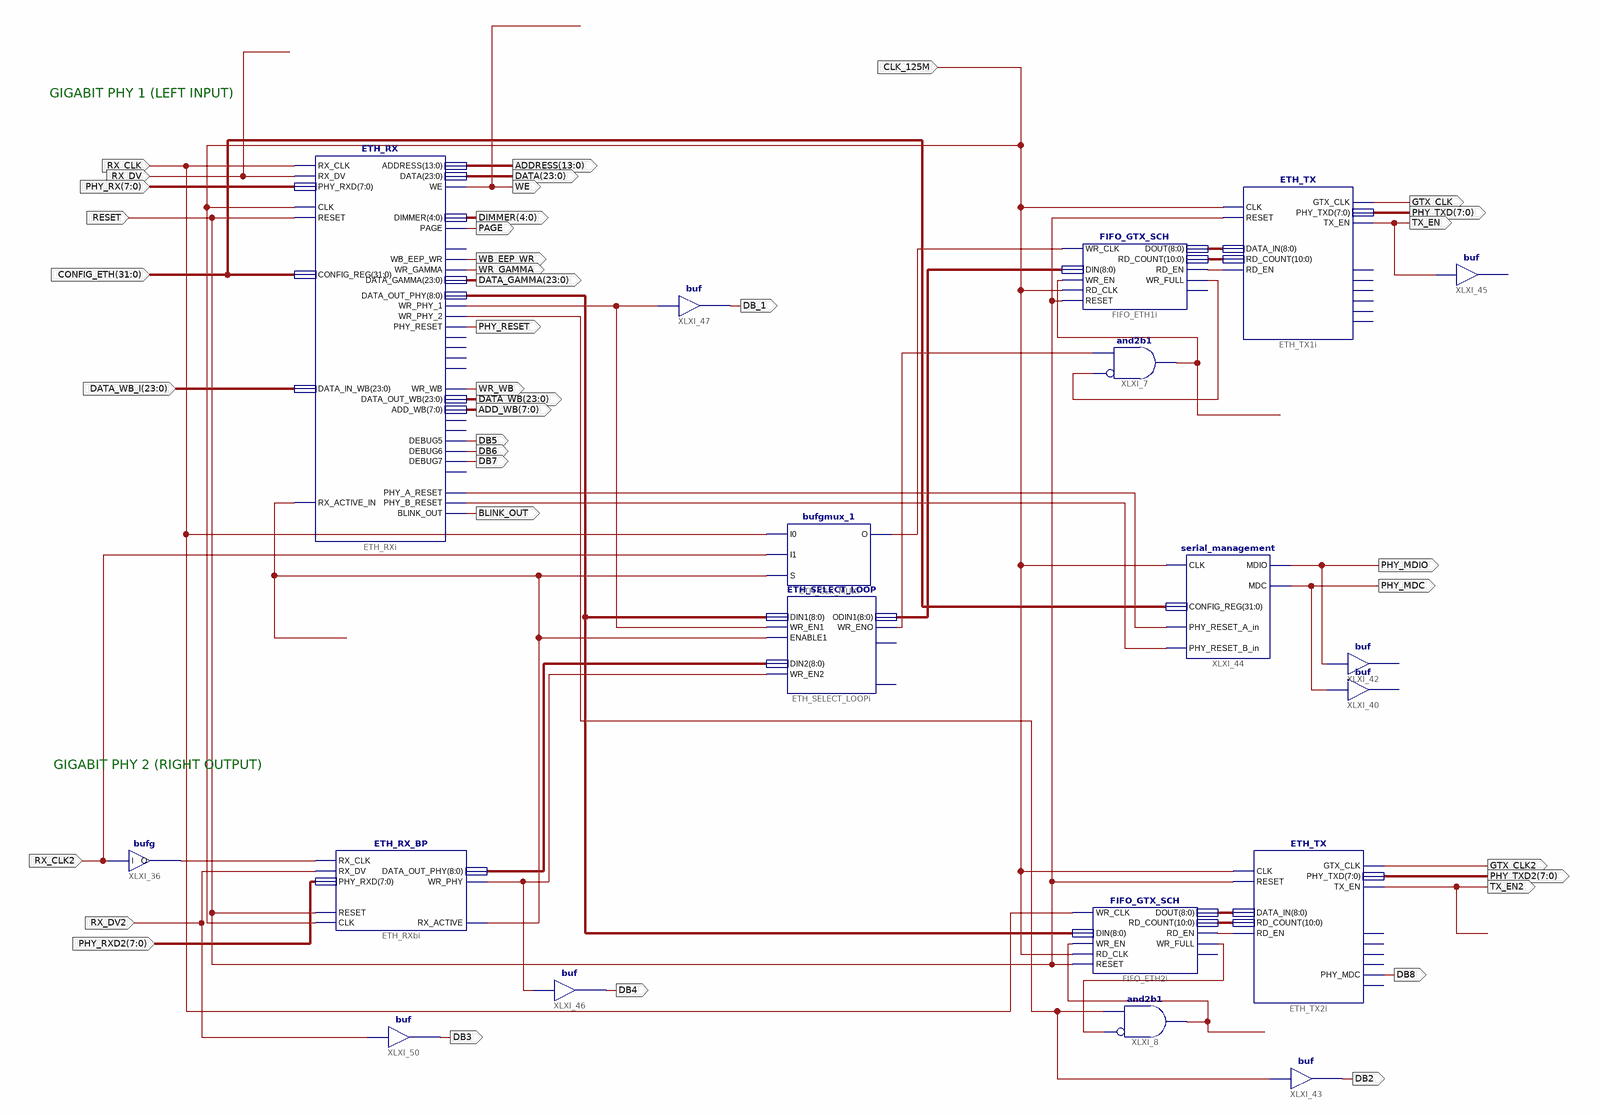
[diagram p0: schematic sheet 1]
// Xilinx ISE schematic ETH_Drive.sch (spartan6) as structural Verilog: 19 symbols, 39 ports
module ETH_Drive (
  input  CLK_125M,
  input  RX_CLK,
  input  RX_DV,
  input  [7:0] PHY_RX,
  input  [31:0] CONFIG_ETH,
  input  [23:0] DATA_WB_I,
  input  RX_DV2,
  input  [7:0] PHY_RXD2,
  input  RX_CLK2,
  input  RESET,
  output [4:0] DIMMER,
  output PAGE,
  output WB_EEP_WR,
  output WR_GAMMA,
  output [23:0] DATA_GAMMA,
  output [23:0] DATA_WB,
  output [7:0] ADD_WB,
  output WR_WB,
  output PHY_RESET,
  output DB5,
  output DB6,
  output DB7,
  output DB8,
  output GTX_CLK2,
  output [7:0] PHY_TXD2,
  output TX_EN2,
  output DB2,
  output PHY_MDIO,
  output PHY_MDC,
  output [13:0] ADDRESS,
  output [23:0] DATA,
  output WE,
  output DB_1,
  output GTX_CLK,
  output [7:0] PHY_TXD,
  output TX_EN,
  output DB3,
  output DB4,
  output BLINK_OUT
);

  wire DB1, XLXN_253, XLXN_254, XLXN_283, XLXN_284, XLXN_285, XLXN_286, XLXN_287, XLXN_292, XLXN_345,
       XLXN_370, XLXN_371, XLXN_372, XLXN_375, XLXN_389;
  wire [8:0] XLXN_1, XLXN_29, XLXN_202, XLXN_232, XLXN_237;
  wire [10:0] XLXN_249, XLXN_250;

  ETH_RX ETH_RXi (
    .CLK(CLK_125M), .RESET(RESET), .RX_CLK(RX_CLK), .RX_DV(RX_DV), .RX_ACTIVE_IN(XLXN_370), .PHY_RXD(PHY_RX),
    .DATA_IN_WB(DATA_WB_I), .CONFIG_REG(CONFIG_ETH), .PHY_RESET(PHY_RESET), .WE(WE), .WR_PHY_1(XLXN_375),
    .WR_PHY_2(XLXN_345), .WR_GAMMA(WR_GAMMA), .WR_WB(WR_WB), .WB_EEP_WR(WB_EEP_WR), .BLINK_OUT(BLINK_OUT),
    .PAGE(PAGE), .PHY_B_RESET(XLXN_372), .PHY_A_RESET(XLXN_371), .DEBUG5(DB5), .DEBUG6(DB6), .DEBUG7(DB7),
    .ADDRESS(ADDRESS), .DATA(DATA), .DATA_OUT_PHY(XLXN_202), .DATA_GAMMA(DATA_GAMMA), .DATA_OUT_WB(DATA_WB),
    .ADD_WB(ADD_WB), .DIMMER(DIMMER));  // open: LED_ERROR_TG, RST_WB_BRAM, LED_OS, DEBUG1, DEBUG2, DEBUG3, DEBUG4, DEBUG8
  and XLXI_7 (XLXN_284, ~XLXN_285, XLXN_283);  // and2b1
  and XLXI_8 (XLXN_287, ~XLXN_286, XLXN_345);  // and2b1
  ETH_RX_BP ETH_RXbi (
    .RX_CLK(XLXN_292), .RX_DV(RX_DV2), .RESET(RESET), .PHY_RXD(PHY_RXD2), .WR_PHY(XLXN_389),
    .DATA_OUT_PHY(XLXN_232), .CLK(CLK_125M), .RX_ACTIVE(XLXN_370));
  bufgmux_1 ETH_CLK_MUXi (.I0(RX_CLK), .I1(RX_CLK2), .S(XLXN_370), .O(DB1));
  bufg XLXI_36 (.I(RX_CLK2), .O(XLXN_292));
  FIFO_GTX_SCH FIFO_ETH2i (
    .WR_CLK(RX_CLK), .WR_EN(XLXN_287), .RD_CLK(CLK_125M), .RD_EN(XLXN_254), .DIN(XLXN_202),
    .WR_FULL(XLXN_286), .DOUT(XLXN_29), .RD_COUNT(XLXN_250), .RESET(RESET));  // open: RD_EMPTY
  FIFO_GTX_SCH FIFO_ETH1i (
    .WR_CLK(DB1), .WR_EN(XLXN_284), .RD_CLK(CLK_125M), .RD_EN(XLXN_253), .DIN(XLXN_237), .WR_FULL(XLXN_285),
    .DOUT(XLXN_1), .RD_COUNT(XLXN_249), .RESET(RESET));  // open: RD_EMPTY
  ETH_TX ETH_TX2i (
    .CLK(CLK_125M), .RESET(RESET), .DATA_IN(XLXN_29), .RD_COUNT(XLXN_250), .GTX_CLK(GTX_CLK2),
    .TX_EN(TX_EN2), .PHY_MDC(DB8), .RD_EN(XLXN_254), .PHY_TXD(PHY_TXD2));  // open: PHY_MDIO, DEBUG1, DEBUG2, DEBUG3, DEBUG4
  ETH_TX ETH_TX1i (
    .CLK(CLK_125M), .RESET(RESET), .DATA_IN(XLXN_1), .RD_COUNT(XLXN_249), .GTX_CLK(GTX_CLK), .TX_EN(TX_EN),
    .RD_EN(XLXN_253), .PHY_TXD(PHY_TXD));  // open: PHY_MDC, PHY_MDIO, DEBUG1, DEBUG2, DEBUG3, DEBUG4
  buf XLXI_43 (DB2, XLXN_345);
  // buf XLXI_42 has open pins: I=PHY_MDIO, O=open
  // buf XLXI_40 has open pins: I=PHY_MDC, O=open
  serial_management XLXI_44 (
    .CLK(CLK_125M), .CONFIG_REG(CONFIG_ETH), .MDIO(PHY_MDIO), .MDC(PHY_MDC), .PHY_RESET_A_in(XLXN_371),
    .PHY_RESET_B_in(XLXN_372));
  ETH_SELECT_LOOP ETH_SELECT_LOOPi (
    .WR_EN1(XLXN_375), .WR_EN2(XLXN_389), .ENABLE1(XLXN_370), .DIN1(XLXN_202), .DIN2(XLXN_232),
    .WR_ENO(XLXN_283), .ODIN1(XLXN_237));  // open: ENABLE, DB
  buf XLXI_47 (DB_1, XLXN_375);
  // buf XLXI_45 has open pins: I=TX_EN, O=open
  buf XLXI_50 (DB3, RX_DV2);
  buf XLXI_46 (DB4, XLXN_389);

  // Notes on the sheet:
  //   GIGABIT PHY 1 (LEFT INPUT)
  //   GIGABIT PHY 2 (RIGHT OUTPUT)
endmodule
